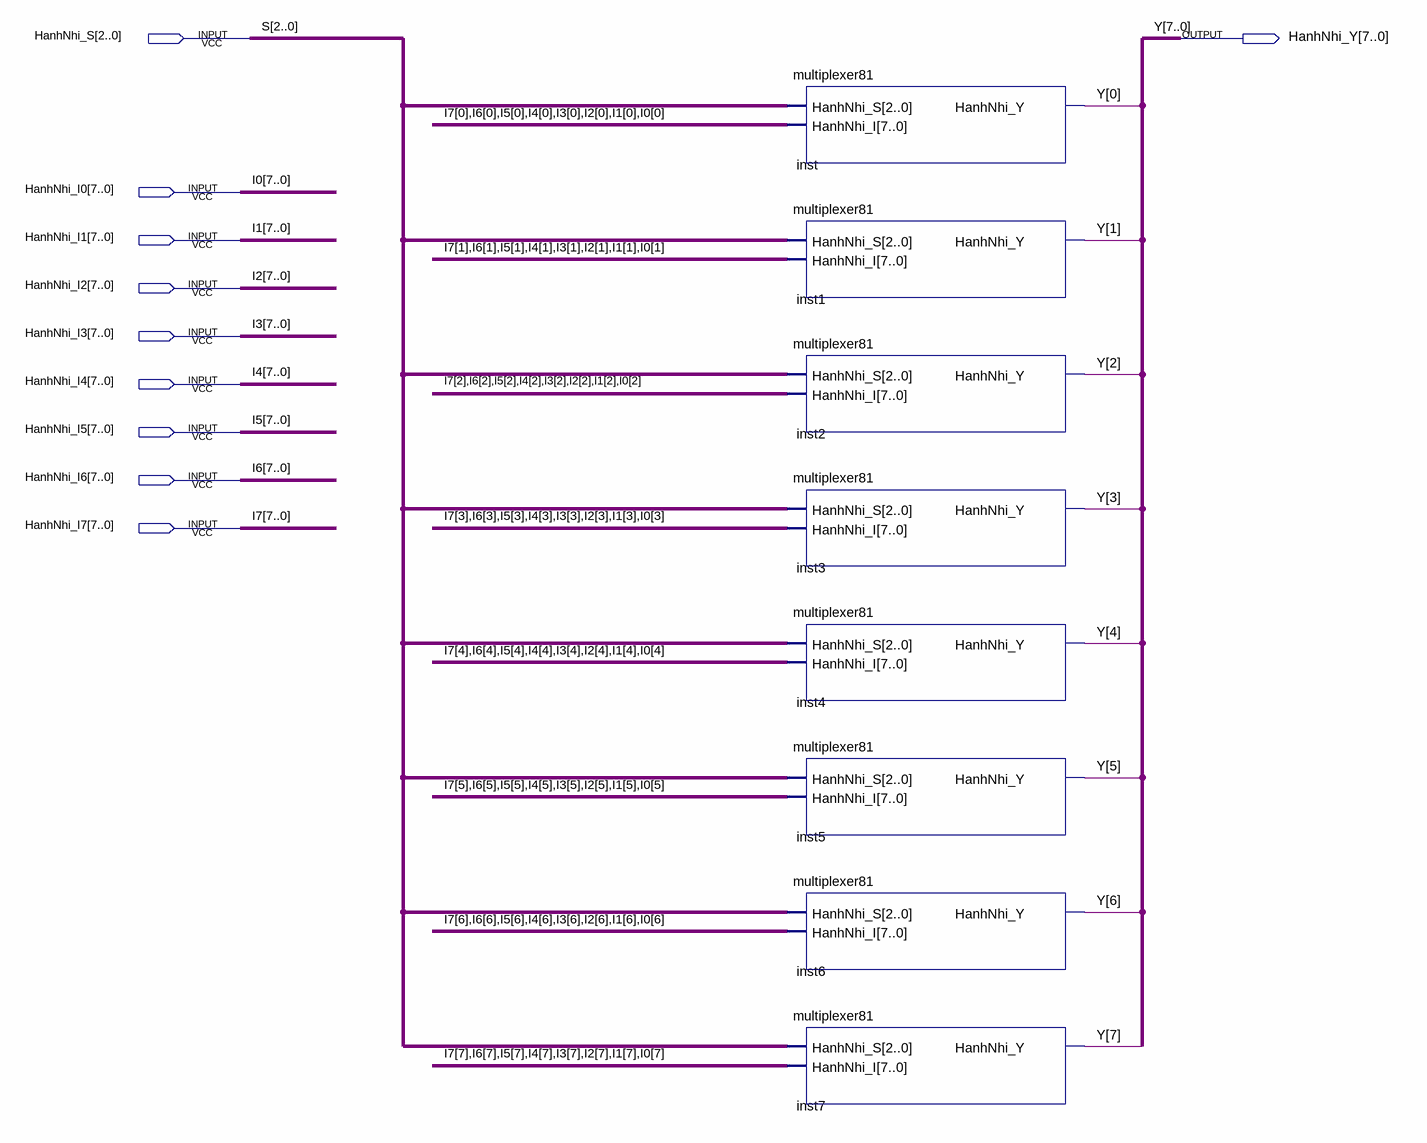
[diagram p0: schematic sheet]
// Quartus schematic multiplexer8_81.bdf as structural Verilog: 8 symbols, 10 pins
module multiplexer8_81 (
  input  [2:0] HanhNhi_S,
  input  [7:0] HanhNhi_I0,
  input  [7:0] HanhNhi_I1,
  input  [7:0] HanhNhi_I2,
  input  [7:0] HanhNhi_I3,
  input  [7:0] HanhNhi_I4,
  input  [7:0] HanhNhi_I5,
  input  [7:0] HanhNhi_I6,
  input  [7:0] HanhNhi_I7,
  output [7:0] HanhNhi_Y
);

  multiplexer81 inst (
    .HanhNhi_S(HanhNhi_S),
    .HanhNhi_I({HanhNhi_I7[0], HanhNhi_I6[0], HanhNhi_I5[0], HanhNhi_I4[0], HanhNhi_I3[0], HanhNhi_I2[0], HanhNhi_I1[0], HanhNhi_I0[0]}),
    .HanhNhi_Y(HanhNhi_Y[0]));
  multiplexer81 inst1 (
    .HanhNhi_S(HanhNhi_S),
    .HanhNhi_I({HanhNhi_I7[1], HanhNhi_I6[1], HanhNhi_I5[1], HanhNhi_I4[1], HanhNhi_I3[1], HanhNhi_I2[1], HanhNhi_I1[1], HanhNhi_I0[1]}),
    .HanhNhi_Y(HanhNhi_Y[1]));
  multiplexer81 inst2 (
    .HanhNhi_S(HanhNhi_S),
    .HanhNhi_I({HanhNhi_I7[2], HanhNhi_I6[2], HanhNhi_I5[2], HanhNhi_I4[2], HanhNhi_I3[2], HanhNhi_I2[2], HanhNhi_I1[2], HanhNhi_I0[2]}),
    .HanhNhi_Y(HanhNhi_Y[2]));
  multiplexer81 inst3 (
    .HanhNhi_S(HanhNhi_S),
    .HanhNhi_I({HanhNhi_I7[3], HanhNhi_I6[3], HanhNhi_I5[3], HanhNhi_I4[3], HanhNhi_I3[3], HanhNhi_I2[3], HanhNhi_I1[3], HanhNhi_I0[3]}),
    .HanhNhi_Y(HanhNhi_Y[3]));
  multiplexer81 inst4 (
    .HanhNhi_S(HanhNhi_S),
    .HanhNhi_I({HanhNhi_I7[4], HanhNhi_I6[4], HanhNhi_I5[4], HanhNhi_I4[4], HanhNhi_I3[4], HanhNhi_I2[4], HanhNhi_I1[4], HanhNhi_I0[4]}),
    .HanhNhi_Y(HanhNhi_Y[4]));
  multiplexer81 inst5 (
    .HanhNhi_S(HanhNhi_S),
    .HanhNhi_I({HanhNhi_I7[5], HanhNhi_I6[5], HanhNhi_I5[5], HanhNhi_I4[5], HanhNhi_I3[5], HanhNhi_I2[5], HanhNhi_I1[5], HanhNhi_I0[5]}),
    .HanhNhi_Y(HanhNhi_Y[5]));
  multiplexer81 inst6 (
    .HanhNhi_S(HanhNhi_S),
    .HanhNhi_I({HanhNhi_I7[6], HanhNhi_I6[6], HanhNhi_I5[6], HanhNhi_I4[6], HanhNhi_I3[6], HanhNhi_I2[6], HanhNhi_I1[6], HanhNhi_I0[6]}),
    .HanhNhi_Y(HanhNhi_Y[6]));
  multiplexer81 inst7 (
    .HanhNhi_S(HanhNhi_S),
    .HanhNhi_I({HanhNhi_I7[7], HanhNhi_I6[7], HanhNhi_I5[7], HanhNhi_I4[7], HanhNhi_I3[7], HanhNhi_I2[7], HanhNhi_I1[7], HanhNhi_I0[7]}),
    .HanhNhi_Y(HanhNhi_Y[7]));

  // Other names for the same wires on the sheet: I0[7:0] = HanhNhi_I0; I1[7:0] = HanhNhi_I1; I2[7:0] = HanhNhi_I2;
  //   I3[7:0] = HanhNhi_I3; I4[7:0] = HanhNhi_I4; I5[7:0] = HanhNhi_I5; I6[7:0] = HanhNhi_I6; I7[7:0] = HanhNhi_I7;
  //   S[2:0] = HanhNhi_S; Y[7:0] = HanhNhi_Y
endmodule
